# Altium schematic sheet DM1092_Battery&Alarm.SchDoc: =project_title (part 3 of 3)
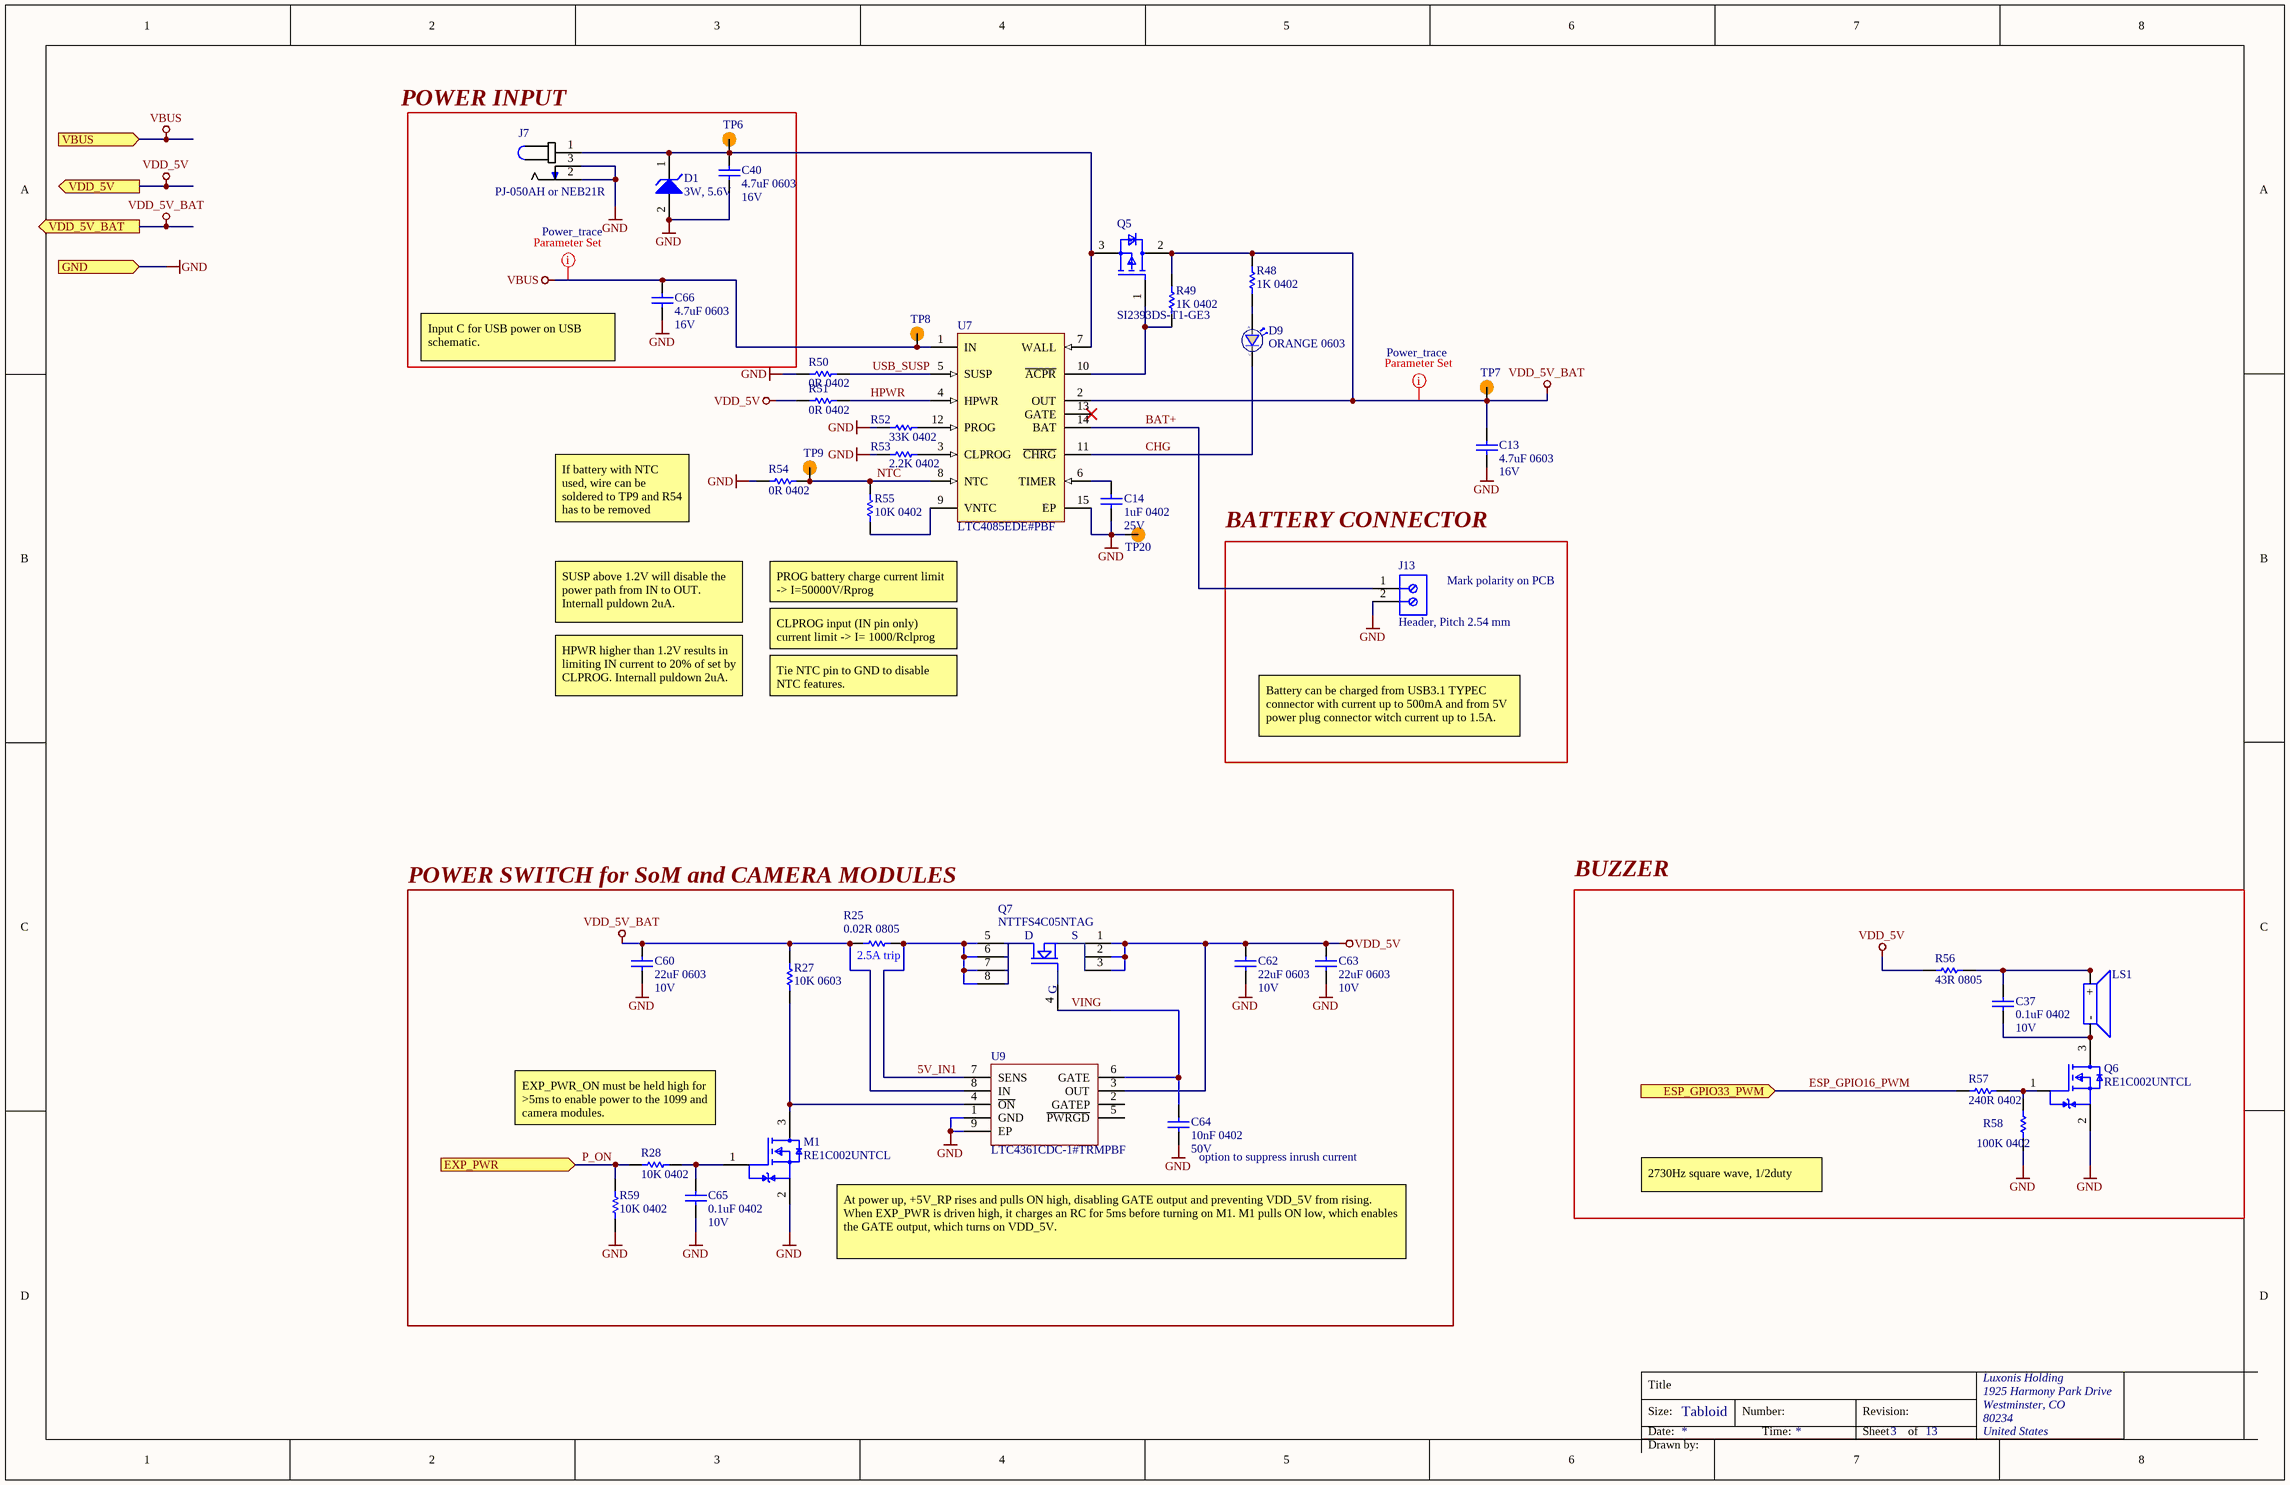
[diagram p2: DM1092_Battery&Alarm.SchDoc]

## Library data of the parts (continued)
R57 = RC0402FR-07240RL: RES SMD 240 OHM 1% 1/16W 0402; Manufacturer 1: Yageo; Temperature Coefficient: 100ppm/°C; Power Rating: 63mW; Voltage Rating: 50V; Supplier 1: Digi-Key; Manufacturer Part Number 1: RC0402FR-07240RL; Stock 1: 5206330; Pricing 1: 1=0.10000, 10=0.01600, 100=0.00640, 1000=0.00289, 2500=0.00251, 5000=0.00207 (USD); RoHS: Yes; Case/Package: 0402; Case Code (Metric): 1005; Case Code (Imperial): 0402; Min Operating Temperature: -55°C; Max Operating Temperature: 155°C; Resistance: 240R; Tolerance: 1%; Packaging: Tape and Reel; Composition: Thick Film; Number of Terminations: 2; Max Power Dissipation: 63mW; Voltage Rating (DC): 50V; Features: Moisture Resistant; Package Quantity: 1; Termination: SMD/SMT; Military Standard: Not; Length: 1mm; Height: 0.016inch; Width: 0.02inch; Depth: 0.5mm; REACH SVHC: Unknown; Lead Free: Lead Free; ComponentLink1URL: https://datasheet.ciiva.com/2519/pyu-r-int-thick-7-2519157.pdf?src-supplier=Digi-Key; ComponentLink1Description: https://datasheet.ciiva.com/2519/pyu-r-int-thick-7-2519157.pdf?src-supplier=Digi-Key; ComponentLink2URL: https://datasheet.ciiva.com/17419/pyu-rc0402-51-rohs-l-6-r-17419482.pdf?src-supplier=Future+Electronics; ComponentLink2Description: https://datasheet.ciiva.com/17419/pyu-rc0402-51-rohs-l-6-r-17419482.pdf?src-supplier=Future+Electronics; ComponentLink3URL: https://datasheet.ciiva.com/2519/pyu-r-int-thick-7-2519156.pdf?src-supplier=Digi-Key; ComponentLink3Description: https://datasheet.ciiva.com/2519/pyu-r-int-thick-7-2519156.pdf?src-supplier=Digi-Key; ComponentLink4URL: https://datasheet.ciiva.com/2519/pyu-r-int-thick-7-2519158.pdf?src-supplier=Digi-Key; ComponentLink4Description: https://datasheet.ciiva.com/2519/pyu-r-int-thick-7-2519158.pdf?src-supplier=Digi-Key; ComponentLink5URL: https://datasheet.ciiva.com/12669/pyu-rc0402-51-rohs-l-6-r-12669689.pdf?src-supplier=Mouser; ComponentLink5Description: https://datasheet.ciiva.com/12669/pyu-rc0402-51-rohs-l-6-r-12669689.pdf?src-supplier=Mouser; ComponentLink6URL: https://datasheet.ciiva.com/7849/1018594-7849915.pdf?src-supplier=Element14; ComponentLink6Description: https://datasheet.ciiva.com/7849/1018594-7849915.pdf?src-supplier=Element14; ComponentLink7URL: https://datasheet.ciiva.com/7849/1018594-7849916.pdf?src-supplier=Element14; ComponentLink7Description: https://datasheet.ciiva.com/7849/1018594-7849916.pdf?src-supplier=Element14; Supplier 2: Mouser; Supplier 3: Newark; Supplier Part Number 1: 311-240LRCT-ND; Supplier Part Number 2: 603-RC0402FR-07240RL; Supplier Part Number 3: 59M4997
R58 = RC0402FR-07100KL: RES SMD 100K OHM 1% 1/16W 0402; Manufacturer 1: Yageo; Resistance: 100kR; Temperature Coefficient: 100ppm/°C; Power Rating: 63mW; Voltage Rating: 50V; Supplier 1: Digi-Key; Supplier Part Number 1: 311-100KLRCT-ND; RoHS: Yes; Stock 1: 50867324; Pricing 1: 1=0.10000, 10=0.01500, 100=0.00600, 1000=0.00270, 2500=0.00235, 5000=0.00194 (USD); Case/Package: 0402; Case Code (Metric): 1005; Case Code (Imperial): 0402; Min Operating Temperature: -55°C; Max Operating Temperature: 155°C; Tolerance: 1%; Packaging: Tape and Reel; Termination: SMD/SMT; Length: 0.039inch; Width: 0.02inch; Height: 0.016inch; Depth: 0.5mm; REACH SVHC: No SVHC; Military Standard: Not; Lead Free: Lead Free; ComponentLink1URL: https://datasheet.ciiva.com/11819/0900766b80c66297-11819452.pdf?src-supplier=RSComponents; ComponentLink1Description: https://datasheet.ciiva.com/11819/0900766b80c66297-11819452.pdf?src-supplier=RSComponents; ComponentLink2URL: https://datasheet.ciiva.com/2453/pyu-r-int-thick-7-2453361.pdf?src-supplier=Digi-Key; ComponentLink2Description: https://datasheet.ciiva.com/2453/pyu-r-int-thick-7-2453361.pdf?src-supplier=Digi-Key; ComponentLink3URL: https://datasheet.ciiva.com/2453/pyu-r-int-thick-7-2453362.pdf?src-supplier=Digi-Key; ComponentLink3Description: https://datasheet.ciiva.com/2453/pyu-r-int-thick-7-2453362.pdf?src-supplier=Digi-Key; ComponentLink4URL: https://datasheet.ciiva.com/2453/pyu-r-int-thick-7-2453363.pdf?src-supplier=Digi-Key; ComponentLink4Description: https://datasheet.ciiva.com/2453/pyu-r-int-thick-7-2453363.pdf?src-supplier=Digi-Key; ComponentLink5URL: https://datasheet.ciiva.com/22747/1018594-22747509.pdf?src-supplier=Element14; ComponentLink5Description: https://datasheet.ciiva.com/22747/1018594-22747509.pdf?src-supplier=Element14; ComponentLink6URL: https://datasheet.ciiva.com/15189/getdatasheetpartid-323696-15189334.pdf?src-supplier=Verical; ComponentLink6Description: https://datasheet.ciiva.com/15189/getdatasheetpartid-323696-15189334.pdf?src-supplier=Verical; ComponentLink7URL: https://datasheet.ciiva.com/12667/pyu-rc0402-51-rohs-l-6-r-12667930.pdf?src-supplier=Mouser; ComponentLink7Description: https://datasheet.ciiva.com/12667/pyu-rc0402-51-rohs-l-6-r-12667930.pdf?src-supplier=Mouser; Manufacturer Part Number 1: RC0402FR-07100KL; Composition: Thick Film; Supplier 2: Newark; Supplier 3: Mouser; Supplier Part Number 2: 67R9887; Supplier Part Number 3: 603-RC0402FR-07100KL; Package Quantity: 1; Number of Terminations: 2; Max Power Dissipation: 63mW; Features: Moisture Resistant; Working Voltage: 50V
TP6-TP9 TP20 = TEST_POINT
U7 = LTC4085EDE#PBF: USB Power Manager with Ideal Diode Controller and Li-Ion Charger with 4.2 V Float Voltage, 29% Vvntc, Undervoltage Current Limit, 4.35 to 5.5 V Vin, 14-pin SON (DE-14), -40 to 85 degC, Pb-Free; Manufacturer: Linear Technology; Manufacturer 1: Analog Devices / Linear Technology; Vin Min(V): 4.35; Number of Cells: 1; Vin Max(V): 5.5; PartNumber: LTC4085EDE#PBF; DatasheetVersion: Rev. D; Code_JEDEC: MO-229; PackageVersion: Rev. B, 06/2010; ComponentLink2Description: Datasheet; ComponentLink2URL: http://cds.linear.com/docs/en/datasheet/4085fd.pdf; Number of Outputs: 1; PackageReference: DE-14; ComponentLink3URL: http://www.linear.com/docs/en/packaging/DFN_14_05-08-1708.pdf; RoHS: TRUE; ComponentLink3Description: Package Specification; Mounting Technology: Surface Mount; PackageDescription: 14-Pin Plastic DFN, Body 4 x 3 mm, Pitch 0.5 mm; ComponentLink1URL: http://www.linear.com/; ComponentLink1Description: Manufacturer URL; Manufacturer Part Number 1: LTC4085EDE#PBF; Supplier 1: Digi-Key; Supplier Part Number 1: LTC4085EDE#PBF-ND
U9 = LTC4361CDC-1#TRMPBF: IC OVERVOLTAGE/CUR PROT 8-DFN Handheld/Mobile Devices PMIC 8-DFN (2x2); Manufacturer 1: Analog Devices / Linear Technology; Min Supply Voltage: 2.5V; Max Supply Voltage: 5.5V; Supplier 1: Digi-Key; Manufacturer Part Number 1: LTC4361CDC-1#TRMPBF; Stock 1: 4205; Pricing 1: 1=3.62000, 25=2.40680, 100=1.99000, 250=1.89048 (USD); RoHS: Yes; Case/Package: DFN; Number of Pins: 8; Min Operating Temperature: 0°C; Max Operating Temperature: 70°C; Package Quantity: 1; Packaging: Tape and Reel; Length: 2mm; REACH SVHC: No SVHC; ComponentLink1URL: https://datasheet.ciiva.com/1569/1441932-1569140.pdf?src-supplier=Farnell; ComponentLink1Description: https://datasheet.ciiva.com/1569/1441932-1569140.pdf?src-supplier=Farnell; ComponentLink2URL: https://datasheet.ciiva.com/1569/1441932-1569141.pdf?src-supplier=Farnell; ComponentLink2Description: https://datasheet.ciiva.com/1569/1441932-1569141.pdf?src-supplier=Farnell; ComponentLink3URL: https://datasheet.ciiva.com/1941/29266-1941719.pdf?src-supplier=Digi-Key; ComponentLink3Description: https://datasheet.ciiva.com/1941/29266-1941719.pdf?src-supplier=Digi-Key; ComponentLink4URL: https://datasheet.ciiva.com/1511/1692593-1511384.pdf?src-supplier=Element14; ComponentLink4Description: https://datasheet.ciiva.com/1511/1692593-1511384.pdf?src-supplier=Element14; ComponentLink5URL: https://datasheet.ciiva.com/1941/29266-1941720.pdf?src-supplier=Digi-Key; ComponentLink5Description: https://datasheet.ciiva.com/1941/29266-1941720.pdf?src-supplier=Digi-Key; ComponentLink6URL: https://datasheet.ciiva.com/1941/29266-1941721.pdf?src-supplier=Digi-Key; ComponentLink6Description: https://datasheet.ciiva.com/1941/29266-1941721.pdf?src-supplier=Digi-Key; Supplier Part Number 1: LTC4361CDC-1#TRMPBFCT-ND